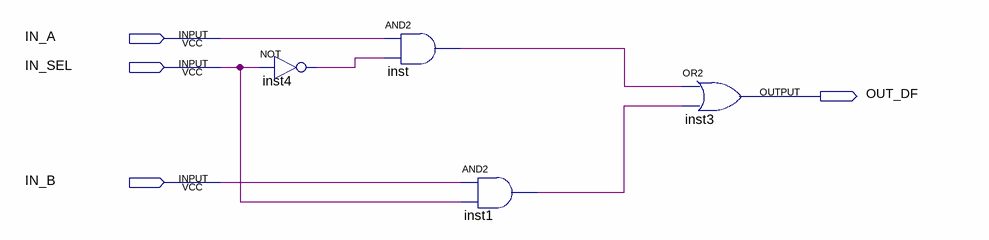
[diagram p0: schematic sheet]
// Quartus schematic LAB5DATAFLOW2.bdf as structural Verilog: 4 symbols, 4 pins
module LAB5DATAFLOW2 (
  input  IN_A,
  input  IN_SEL,
  input  IN_B,
  output OUT_DF
);

  wire inst1_out, inst4_out, inst_out;

  not inst4 (inst4_out, IN_SEL);
  and inst (inst_out, IN_A, inst4_out);
  and inst1 (inst1_out, IN_B, IN_SEL);
  or inst3 (OUT_DF, inst_out, inst1_out);
endmodule
